# EAGLE design motor controller rev 3.0.6 (EAGLE 8.6.0)

## Sheet 1 of 2
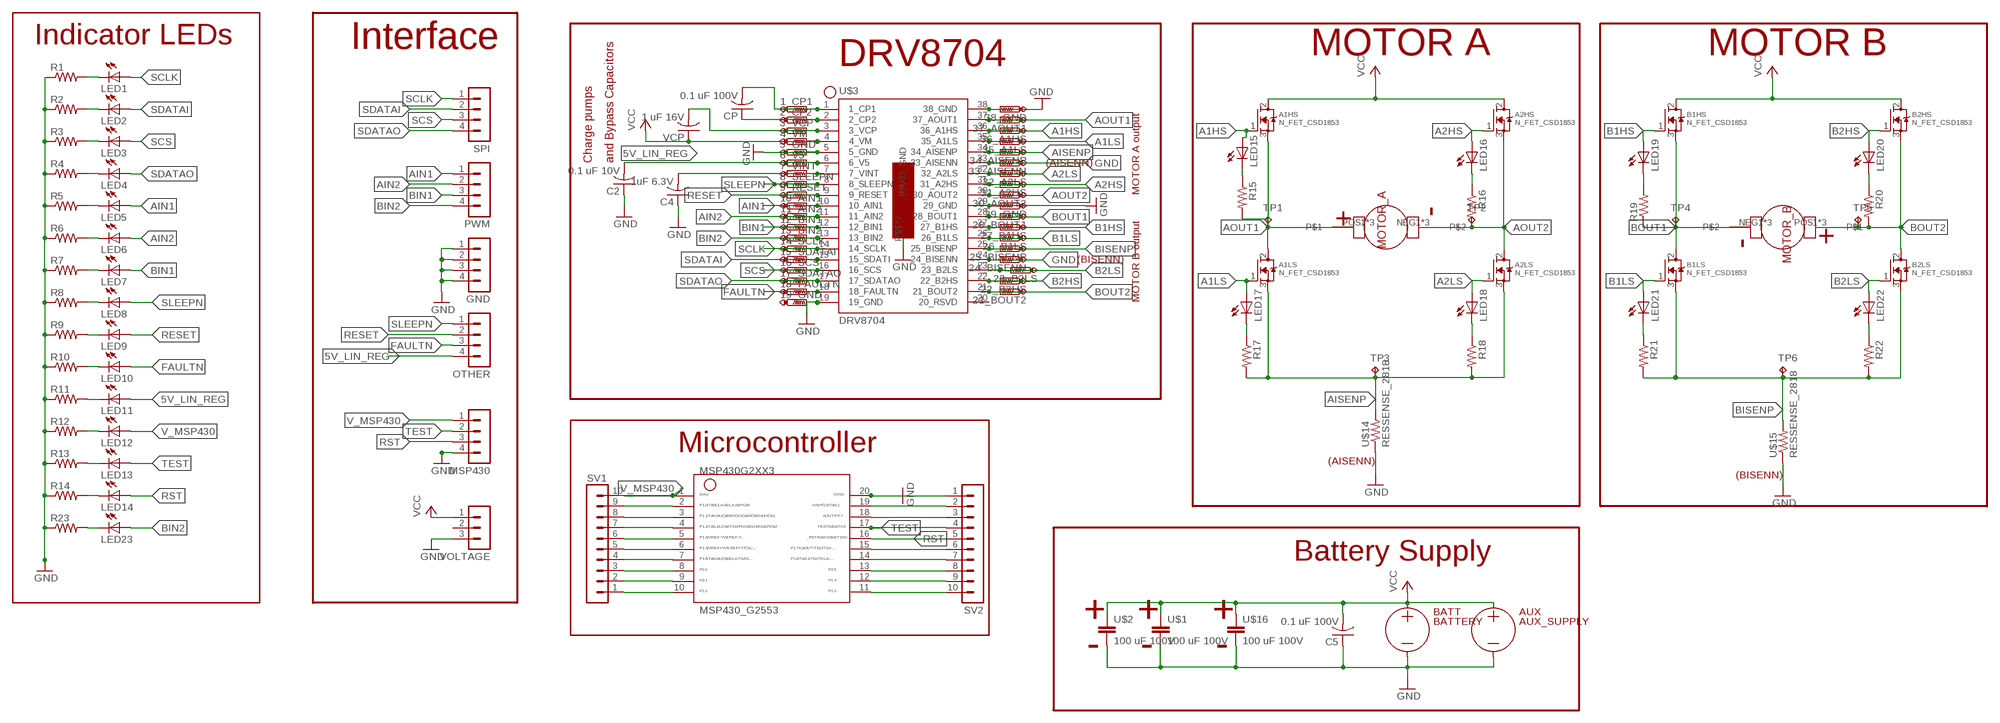
[diagram p0: schematic, sheet 1]

### Parts
1_CP1  PTR1TP10R  [TP10R]
2_CP2  PTR1TP10R  [TP10R]
3_VCP  PTR1TP10R  [TP10R]
4_VM  PTR1TP10R  [TP10R]
5_GND  PTR1TP10R  [TP10R]
6_V5  PTR1TP10R  [TP10R]
7_VINT  PTR1TP10R  [TP10R]
8_SLEEPN  PTR1TP10R  [TP10R]
9_RESET  PTR1TP10R  [TP10R]
10_AIN1  PTR1TP10R  [TP10R]
11_AIN2  PTR1TP10R  [TP10R]
12_BIN1  PTR1TP10R  [TP10R]
13_BIN2  PTR1TP10R  [TP10R]
14_SCLK  PTR1TP10R  [TP10R]
15_SDATAI  PTR1TP10R  [TP10R]
16_SCS  PTR1TP10R  [TP10R]
17_SDATAO  PTR1TP10R  [TP10R]
18_FAULTN  PTR1TP10R  [TP10R]
19_GND  PTR1TP10R  [TP10R]
21_BOUT2  PTR1TP10R  [TP10R]
22_B2HS  PTR1TP10R  [TP10R]
23_B2LS  PTR1TP10R  [TP10R]
24_BISENN  PTR1TP10R  [TP10R]
25_BISENP  PTR1TP10R  [TP10R]
26_B1LS  PTR1TP10R  [TP10R]
27_B1HS  PTR1TP10R  [TP10R]
28_BOUT1  PTR1TP10R  [TP10R]
29_GND  PTR1TP10R  [TP10R]
30_AOUT2  PTR1TP10R  [TP10R]
31_A2HS  PTR1TP10R  [TP10R]
32_A2LS  PTR1TP10R  [TP10R]
33_AISENN  PTR1TP10R  [TP10R]
34_AISENP  PTR1TP10R  [TP10R]
35_A1LS  PTR1TP10R  [TP10R]
36_A1HS  PTR1TP10R  [TP10R]
37_AOUT1  PTR1TP10R  [TP10R]
38_GND  PTR1TP10R  [TP10R]
A1HS  N_FET_CSD1853  [GDS_NFET]
A1LS  N_FET_CSD1853  [GDS_NFET]
A2HS  N_FET_CSD1853  [GDS_NFET]
A2LS  N_FET_CSD1853  [GDS_NFET]
AUX  AUX_SUPPLY  [PP14-45_RIGHT_ANGLE]
B1HS  N_FET_CSD1853  [GDS_NFET]
B1LS  N_FET_CSD1853  [GDS_NFET]
B2HS  N_FET_CSD1853  [GDS_NFET]
B2LS  N_FET_CSD1853  [GDS_NFET]
BATT  BATTERY  [SB50POWER_CLAW]
C2  0.1 uF 10V  C-USC0805K  [C0805K]
C4  1uF 6.3V  C-USC0805K  [C0805K]
C5  0.1 uF 100V  C-USC0805K  [C0805K]
CP  0.1 uF 100V  C-USC0805K  [C0805K]
GND  MA04-1  [MA04-1]
LED1  LEDCHIPLED_0805  [CHIPLED_0805]
LED2  LEDCHIPLED_0805  [CHIPLED_0805]
LED3  LEDCHIPLED_0805  [CHIPLED_0805]
LED4  LEDCHIPLED_0805  [CHIPLED_0805]
LED5  LEDCHIPLED_0805  [CHIPLED_0805]
LED6  LEDCHIPLED_0805  [CHIPLED_0805]
LED7  LEDCHIPLED_0805  [CHIPLED_0805]
LED8  LEDCHIPLED_0805  [CHIPLED_0805]
LED9  LEDCHIPLED_0805  [CHIPLED_0805]
LED10  LEDCHIPLED_0805  [CHIPLED_0805]
LED11  LEDCHIPLED_0805  [CHIPLED_0805]
LED12  LEDCHIPLED_0805  [CHIPLED_0805]
LED13  LEDCHIPLED_0805  [CHIPLED_0805]
LED14  LEDCHIPLED_0805  [CHIPLED_0805]
LED15  LEDCHIPLED_0805  [CHIPLED_0805]
LED16  LEDCHIPLED_0805  [CHIPLED_0805]
LED17  LEDCHIPLED_0805  [CHIPLED_0805]
LED18  LEDCHIPLED_0805  [CHIPLED_0805]
LED19  LEDCHIPLED_0805  [CHIPLED_0805]
LED20  LEDCHIPLED_0805  [CHIPLED_0805]
LED21  LEDCHIPLED_0805  [CHIPLED_0805]
LED22  LEDCHIPLED_0805  [CHIPLED_0805]
LED23  LEDCHIPLED_0805  [CHIPLED_0805]
MOTOR_A  MOTOR  [SB50POWER_CLAW]
MOTOR_B  MOTOR  [SB50POWER_CLAW]
MSP430  MA04-1  [MA04-1]
MSP430_G2553  G2XX3---N20  [N20]
OTHER  MA04-1  [MA04-1]
PWM  MA04-1  [MA04-1]
R1  R-US_R0805  [R0805]
R2  R-US_R0805  [R0805]
R3  R-US_R0805  [R0805]
R4  R-US_R0805  [R0805]
R5  R-US_R0805  [R0805]
R6  R-US_R0805  [R0805]
R7  R-US_R0805  [R0805]
R8  R-US_R0805  [R0805]
R9  R-US_R0805  [R0805]
R10  R-US_R0805  [R0805]
R11  R-US_R0805  [R0805]
R12  R-US_R0805  [R0805]
R13  R-US_R0805  [R0805]
R14  R-US_R0805  [R0805]
R15  R-US_R0805  [R0805]
R16  R-US_R0805  [R0805]
R17  R-US_R0805  [R0805]
R18  R-US_R0805  [R0805]
R19  R-US_R0805  [R0805]
R20  R-US_R0805  [R0805]
R21  R-US_R0805  [R0805]
R22  R-US_R0805  [R0805]
R23  R-US_R0805  [R0805]
SPI  MA04-1  [MA04-1]
SV1  MA10-1  [MA10-1]
SV2  MA10-1  [MA10-1]
TP1  TPB2,54  [B2,54]
TP2  TPB2,54  [B2,54]
TP3  TPB2,54  [B2,54]
TP4  TPB2,54  [B2,54]
TP5  TPB2,54  [B2,54]
TP6  TPB2,54  [B2,54]
U$1  100 uF 100V  LARGE_CAP  [UCY_HD_CAP]
U$2  100 uF 100V  LARGE_CAP  [UCY_HD_CAP]
U$3  DRV8704  [HTSSOP-38]
U$14  RESSENSE_2818  [2818_WITH_VIA]
U$15  RESSENSE_2818  [2818_WITH_VIA]
U$16  100 uF 100V  LARGE_CAP  [UCY_HD_CAP]
VCP  1 uF 16V  C-USC0805K  [C0805K]
VOLTAGE  MA03-1  [MA03-1]

### Nets
1_CP1: 1_CP1.TP CP.2 U$3.1(1_CP1)
2_CP2: 2_CP2.TP CP.1 U$3.2(2_CP2)
5V_LIN_REG: 6_V5.TP C2.2 LED11.A OTHER.4 U$3.6(6_V5)
A1HS: 36_A1HS.TP A1HS.1(G) LED15.A U$3.36(36_A1HS)
A1LS: 35_A1LS.TP A1LS.1(G) LED17.A U$3.35(35_A1LS)
A2HS: 31_A2HS.TP A2HS.1(G) LED16.A U$3.31(31_A2HS)
A2LS: 32_A2LS.TP A2LS.1(G) LED18.A U$3.32(32_A2LS)
AIN1: 10_AIN1.TP LED5.A PWM.1 U$3.10(10_AIN1)
AIN2: 11_AIN2.TP LED6.A PWM.2 U$3.11(11_AIN2)
AISENP: 34_AISENP.TP A1LS.3(S) A2LS.3(S) R17.2 R18.2 TP3.TP U$3.34(34_AISENP) U$14.P2.2 U$14.P$2
AOUT1: 37_AOUT1.TP A1HS.3(S) A1LS.2(D) MOTOR_A.POS1 MOTOR_A.POS2 MOTOR_A.POS3 R15.2 TP1.TP U$3.37(37_AOUT1)
AOUT2: 30_AOUT2.TP A2HS.3(S) A2LS.2(D) MOTOR_A.NEG1 MOTOR_A.NEG2 MOTOR_A.NEG3 R16.2 TP2.TP U$3.30(30_AOUT2)
B1HS: 27_B1HS.TP B1HS.1(G) LED19.A U$3.27(27_B1HS)
B1LS: 26_B1LS.TP B1LS.1(G) LED21.A U$3.26(26_B1LS)
B2HS: 22_B2HS.TP B2HS.1(G) LED20.A U$3.22(22_B2HS)
B2LS: 23_B2LS.TP B2LS.1(G) LED22.A U$3.23(23_B2LS)
BIN1: 12_BIN1.TP LED7.A PWM.3 U$3.12(12_BIN1)
BIN2: 13_BIN2.TP LED23.A PWM.4 U$3.13(13_BIN2)
BISENP: 25_BISENP.TP B1LS.3(S) B2LS.3(S) R21.2 R22.2 TP6.TP U$3.25(25_BISENP) U$15.P2.2 U$15.P$2
BOUT1: 28_BOUT1.TP B1HS.3(S) B1LS.2(D) MOTOR_B.NEG1 MOTOR_B.NEG2 MOTOR_B.NEG3 R19.1 TP4.TP U$3.28(28_BOUT1)
BOUT2: 21_BOUT2.TP B2HS.3(S) B2LS.2(D) MOTOR_B.POS1 MOTOR_B.POS2 MOTOR_B.POS3 R20.2 TP5.TP U$3.21(21_BOUT2)
FAULTN: 18_FAULTN.TP LED10.A OTHER.3 U$3.18(18_FAULTN)
GND: 5_GND.TP 19_GND.TP 24_BISENN.TP 29_GND.TP 33_AISENN.TP 38_GND.TP AUX.P$1(-) BATT.NEG1(-) BATT.NEG2(-) BATT.NEG3(-) C2.1 C4.1 C5.1 GND.1 GND.2 GND.3 GND.4 MSP430.4 MSP430_G2553.20 R1.1 R2.1 R3.1 R4.1 R5.1 R6.1 R7.1 R8.1 R9.1 R10.1 R11.1 R12.1 R13.1 R14.1 R23.1 SV2.1 U$1.- U$2.- U$3.5(5_GND) U$3.19(19_GND) U$3.24(24_BISENN) U$3.29(29_GND) U$3.33(33_AISENN) U$3.38(38_GND) U$3.P$1(PPAD_GND) U$3.P$2(PPAD_GND) U$3.P$3(PPAD_GND) U$3.P$4(PPAD_GND) U$3.PPAD0(PPAD_GND) U$3.PPAD1(PPAD_GND) U$3.PPAD2(PPAD_GND) U$14.P1.1 U$14.P$1 U$15.P1.1 U$15.P$1 U$16.- VOLTAGE.3
N$2: MSP430_G2553.2 SV1.9
N$3: MSP430_G2553.3 SV1.8
N$4: MSP430_G2553.4 SV1.7
N$5: MSP430_G2553.5 SV1.6
N$6: MSP430_G2553.6 SV1.5
N$7: MSP430_G2553.7 SV1.4
N$8: MSP430_G2553.8 SV1.3
N$9: MSP430_G2553.9 SV1.2
N$10: MSP430_G2553.10 SV1.1
N$11: MSP430_G2553.11 SV2.10
N$12: MSP430_G2553.12 SV2.9
N$13: MSP430_G2553.13 SV2.8
N$14: MSP430_G2553.14 SV2.7
N$15: MSP430_G2553.15 SV2.6
N$16: MSP430_G2553.18 SV2.3
N$17: MSP430_G2553.19 SV2.2
N$18: LED1.C R1.2
N$19: LED2.C R2.2
N$20: LED3.C R3.2
N$21: LED4.C R4.2
N$22: LED5.C R5.2
N$23: LED6.C R6.2
N$24: LED7.C R7.2
N$26: LED15.C R15.1
N$27: LED17.C R17.1
N$28: LED18.C R18.1
N$29: LED16.C R16.1
N$30: LED19.C R19.2
N$31: LED20.C R20.1
N$32: LED22.C R22.1
N$33: LED21.C R21.1
N$36: LED23.C R23.2
N$45: LED14.C R14.2
N$46: LED13.C R13.2
N$47: LED12.C R12.2
N$48: LED11.C R11.2
N$49: LED10.C R10.2
N$50: LED9.C R9.2
N$51: LED8.C R8.2
RESET: 9_RESET.TP LED9.A OTHER.2 U$3.9(9_RESET)
RST: LED14.A MSP430.3 MSP430_G2553.16 SV2.5
SCLK: 14_SCLK.TP LED1.A SPI.1 U$3.14(14_SCLK)
SCS: 16_SCS.TP LED3.A SPI.3 U$3.16(16_SCS)
SDATAI: 15_SDATAI.TP LED2.A SPI.2 U$3.15(15_SDATI)
SDATAO: 17_SDATAO.TP LED4.A SPI.4 U$3.17(17_SDATAO)
SLEEPN: 8_SLEEPN.TP LED8.A OTHER.1 U$3.8(8_SLEEPN)
TEST: LED13.A MSP430.2 MSP430_G2553.17 SV2.4
V_MSP430: LED12.A MSP430.1 MSP430_G2553.1 SV1.10
VCC: 4_VM.TP A1HS.2(D) A2HS.2(D) AUX.P$2(+) B1HS.2(D) B2HS.2(D) BATT.POS1(+) BATT.POS2(+) BATT.POS3(+) C5.2 U$1.+ U$2.+ U$3.4(4_VM) U$16.+ VCP.1 VOLTAGE.1
VCP: 3_VCP.TP U$3.3(3_VCP) VCP.2
VINT: 7_VINT.TP C4.2 U$3.7(7_VINT)
Unconnected: U$3.20(20_RSVD) VOLTAGE.2

### Notes on the sheet
- Indicator LEDs | Interface
- DRV8704 | MOTOR A | MOTOR B
- Charge pumps | and Bypass Capacitors
- (AISENN)
- MOTOR A output
- (BISENN)
- MOTOR B output
- Microcontroller
- (AISENN)
- (BISENN)
- Battery Supply

## Sheet 2 of 2

## Library data of the parts
1_CP1 2_CP2 3_VCP 4_VM 5_GND 6_V5 7_VINT 8_SLEEPN 9_RESET 10_AIN1 11_AIN2 12_BIN1 13_BIN2 14_SCLK 15_SDATAI 16_SCS 17_SDATAO 18_FAULTN 19_GND 21_BOUT2 22_B2HS 23_B2LS 24_BISENN 25_BISENP 26_B1LS 27_B1HS 28_BOUT1 29_GND 30_AOUT2 31_A2HS 32_A2LS 33_AISENN 34_AISENP 35_A1LS 36_A1HS 37_AOUT1 38_GND = motor controller rev 3.0.6:PTR1: TEST PIN
A1HS A1LS A2HS A2LS B1HS B1LS B2HS B2LS = motor controller rev 3.0.6:N_FET_CSD1853
AUX = motor controller rev 3.0.6:AUX_SUPPLY: Used for sending 48V to the buck converter that connects to the auxillary circuit
BATT = motor controller rev 3.0.6:BATTERY
C2 C4 C5 CP VCP = motor controller rev 3.0.6:C-US: CAPACITOR, American symbol
GND MSP430 OTHER PWM SPI = motor controller rev 3.0.6:MA04-1: PIN HEADER; OC_FARNELL: unknown; OC_NEWARK: unknown
LED1-LED23 = motor controller rev 3.0.6:LED: LED OSRAM: - CHIPLED LG R971, LG N971, LY N971, LG Q971, LY Q971, LO R971, LY R971 LH N974, LH R974 LS Q976, LO Q976, LY Q976 LO Q996 - Hyper CHIPLED LW Q18S LB Q993, LB Q99A, LB R99A - SideLED LS A670, LO A670, LY A670, LG A670, LP A670 LB A673, LV A673, LT A673, LW A673 LH A674 LY A675 LS A676, LA A676, LO A676, LY A676, LW A676 LS A679, LY A679, LG A679 - Hyper Micro SIDELED® LS Y876, LA Y876, LO Y876, LY Y876 LT Y87S - SmartLED LW L88C, LW L88S LB L89C, LB L89S, LG L890 LS L89K, LO L89K, LY L89K LS L896, LA L896, LO L896, LY L896 - TOPLED LS T670, LO T670, LY T670, LG T670, LP T670 LSG T670, LSP T670, LSY T670, LOP T670, LYG T670 LG T671, LOG T671, LSG T671 LB T673, LV T673, LT T673, LW T673 LH T674 LS T676, LA T676, LO T676, LY T676, LB T676, LH T676, LSB T676, LW T676 LB T67C, LV T67C, LT T67C, LS T67K, LO T67K, LY T67K, LW E67C LS E67B, LA E67B, LO E67B, LY E67B, LB E67C, LV E67C, LT E67C LW T67C LS T679, LY T679, LG T679 LS T770, LO T770, LY T770, LG T770, LP T770 LB T773, LV T773, LT T773, LW T773 LH T774 LS E675, LA E675, LY E675, LS T675 LS T776, LA T776, LO T776, LY T776, LB T776 LHGB T686 LT T68C, LB T68C - Hyper Mini TOPLED® LB M676 - Mini TOPLED Santana® LG M470 LS M47K, LO M47K, LY M47K Source: http://www.osram.convergy.de LUXEON: - LUMILED® LXK2-PW12-R00, LXK2-PW12-S00, LXK2-PW14-U00, LXK2-PW14-V00 LXK2-PM12-R00, LXK2-PM12-S00, LXK2-PM14-U00 LXK2-PE12-Q00, LXK2-PE12-R00, LXK2-PE12-S00, LXK2-PE14-T00, LXK2-PE14-U00 LXK2-PB12-K00, LXK2-PB12-L00, LXK2-PB12-M00, LXK2-PB14-N00, LXK2-PB14-P00, LXK2-PB14-Q00 LXK2-PR12-L00, LXK2-PR12-M00, LXK2-PR14-Q00, LXK2-PR14-R00 LXK2-PD12-Q00, LXK2-PD12-R00, LXK2-PD12-S00 LXK2-PH12-R00, LXK2-PH12-S00 LXK2-PL12-P00, LXK2-PL12-Q00, LXK2-PL12-R00 Source: www.luxeon.com KINGBRIGHT: KA-3528ASYC Source: www.kingbright.com
MOTOR_A MOTOR_B = motor controller rev 3.0.6:MOTOR
MSP430_G2553 = motor controller rev 3.0.6:G2XX3---N20: MSP430G2XX1 PDIP (N) 20 Pin Package
R1-R23 = motor controller rev 3.0.6:R-US_: RESISTOR, American symbol
SV1 SV2 = motor controller rev 3.0.6:MA10-1: PIN HEADER; OC_FARNELL: unknown; OC_NEWARK: unknown
TP1-TP6 = motor controller rev 3.0.6:TP: Test pad
U$1 U$2 U$16 = motor controller rev 3.0.6:LARGE_CAP
U$3 = motor controller rev 3.0.6:DRV8704
U$14 U$15 = motor controller rev 3.0.6:RESSENSE_2818
VOLTAGE = motor controller rev 3.0.6:MA03-1: PIN HEADER; OC_FARNELL: unknown; OC_NEWARK: unknown

## Board
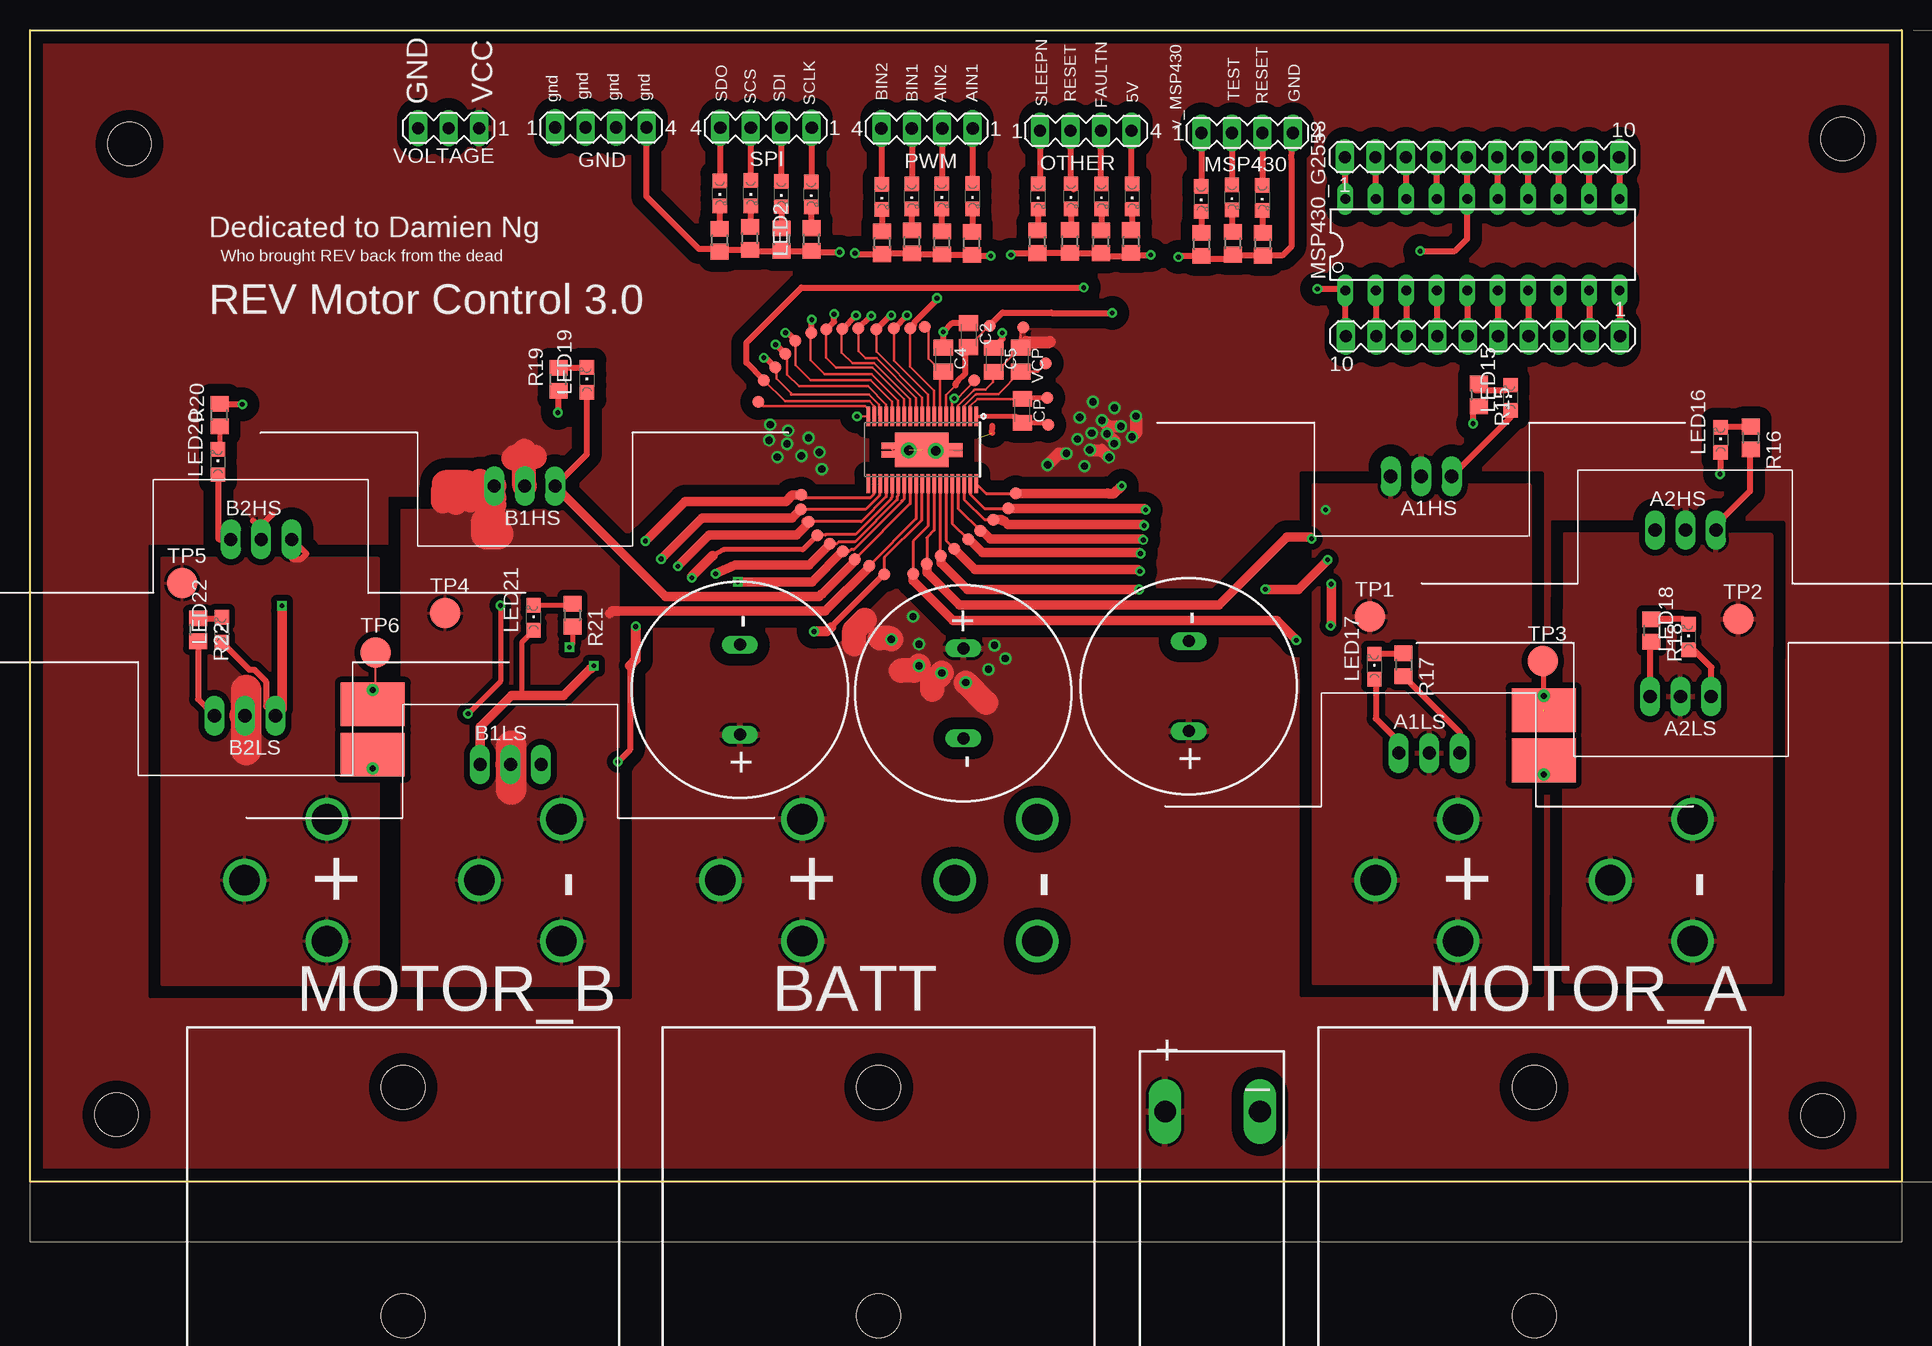
[diagram p1: board, top side]
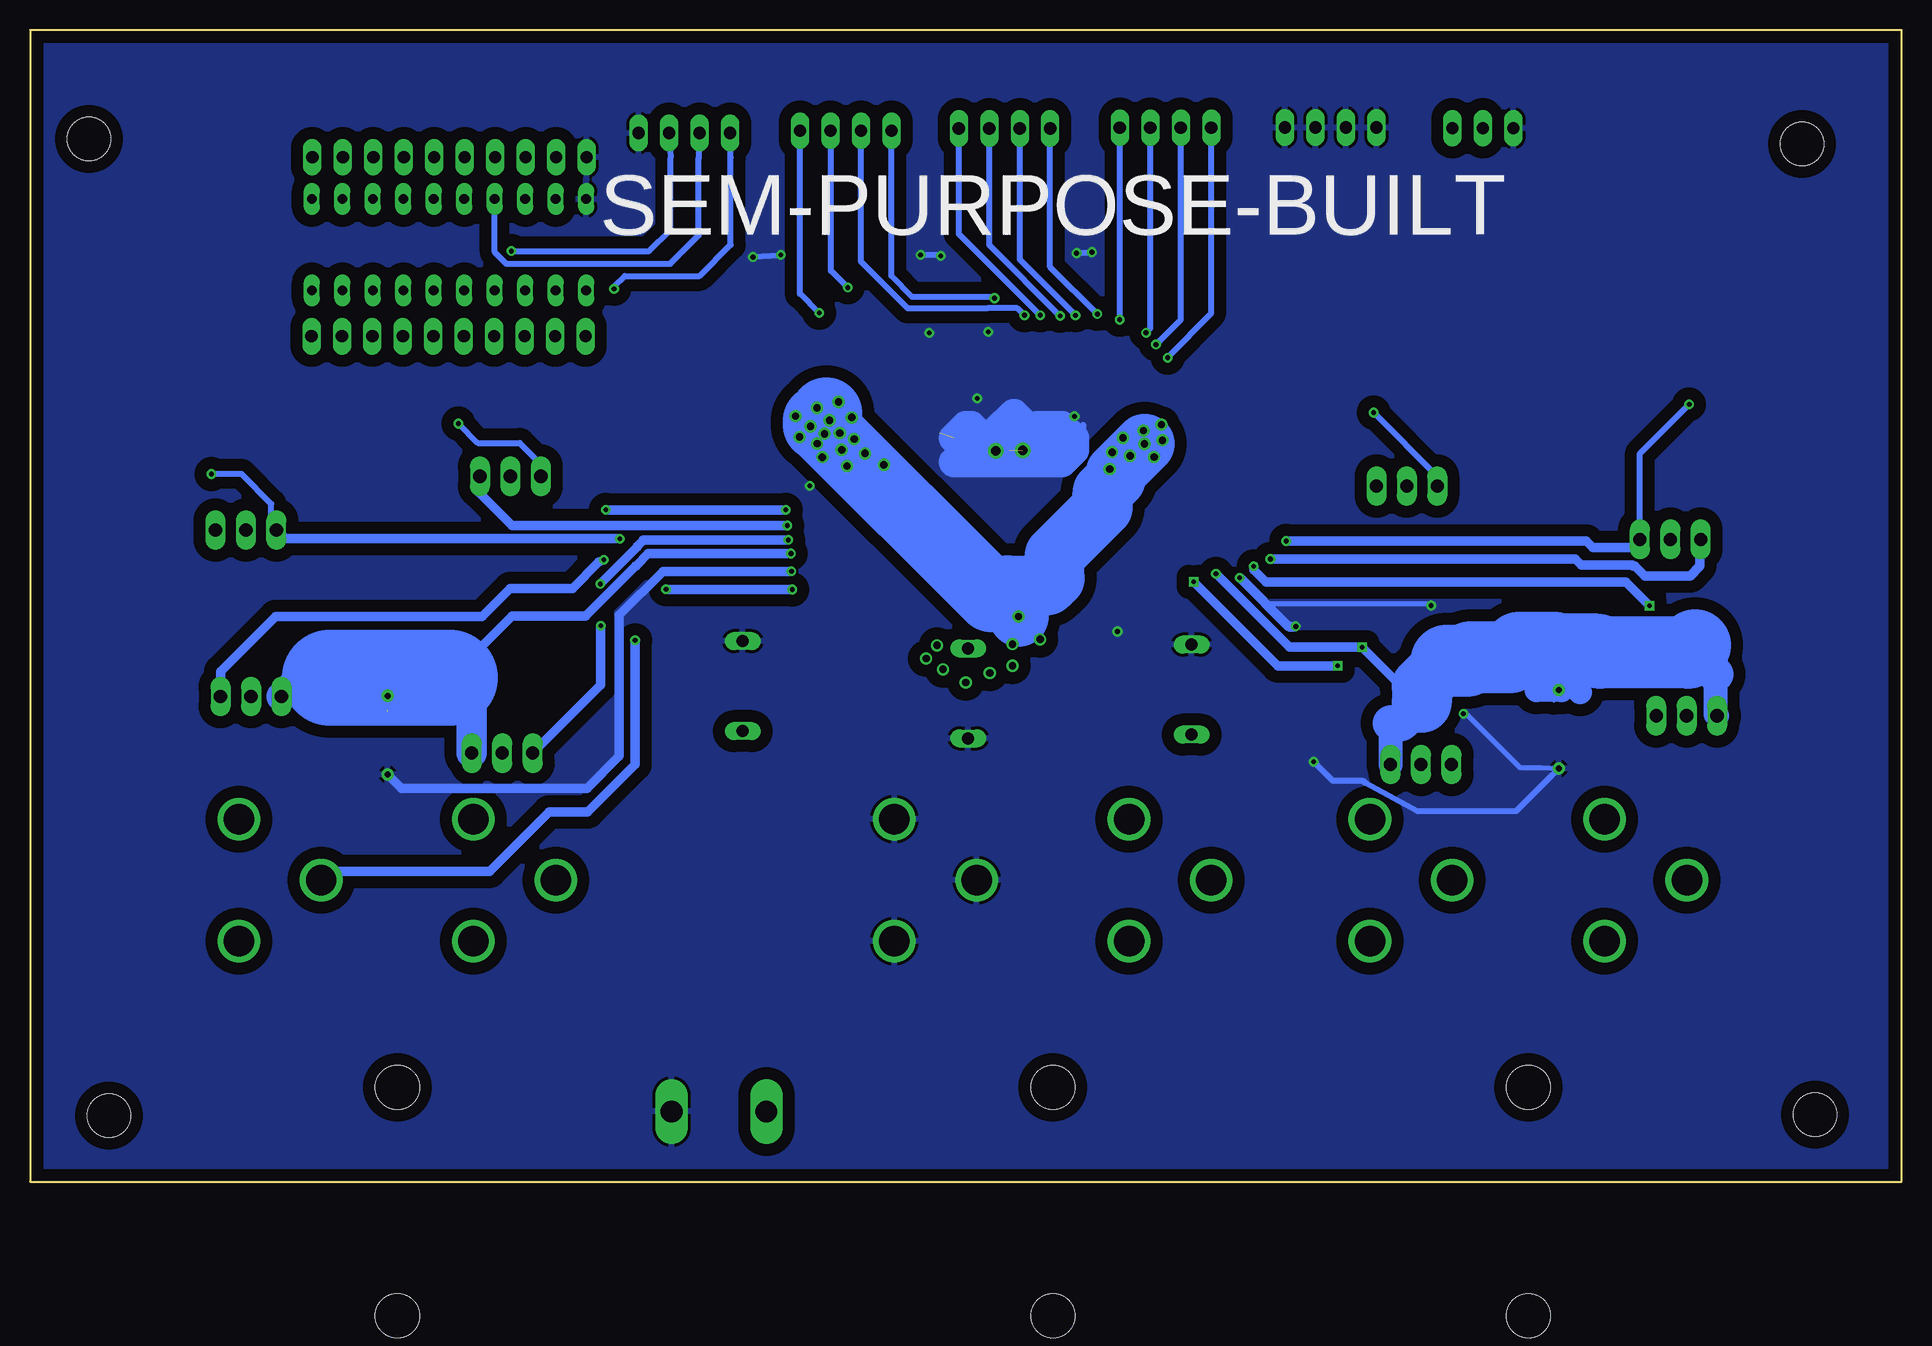
[diagram p2: board, bottom side, seen from below]

Size 156 x 96 mm. Coordinates in mm from the lower left corner, seen from the top.
Outline: 0,96 156,96 156,0 0,0 0,96
Copper layers (1*16): Top 0.035mm / dielectric 1.5mm / Bottom 0.035mm
Design rules "default *": minimum track width 6mil, minimum drill 0.4mm, track to track 6mil, track to pad 6mil, pad to pad 6mil, via to via 6mil, smd to smd 6mil, copper to edge 40mil, drill to drill 0.4mm, minimum pad ring 10mil, minimum via ring 8mil, stop-mask expansion 4mil, vias tented up to drill 0mil, thermal gap 10mil
Holes 3.6 mm at 7.2,5.6 8.3,86.5 151.1,86.9 149.4,5.5

### Footprints (pad centres in the part's own frame; a part is rotated, then mirrored left to right if it is on the bottom)
TP10R = smd 1 x 1: TP 0,0
GDS_NFET = drill 1.1 long: 1 -3.54,0; 2 -1,0; 3 1.54,0
PP14-45_RIGHT_ANGLE = drill 1.8 long: P$1 0,0; P$2 7.9,0
SB50POWER_CLAW = drill 2.54: NEG1 -22.35,13.21; NEG2 -17.27,6.35; NEG3 -12.19,13.21; POS1 -22.35,-6.35; POS2 -17.27,-13.21; POS3 -12.19,-6.35 | hole 3.66: 0,0; 19.05,0
C0805K = smd 1.3 x 1.6: 1 -1,0; 2 1,0
MA04-1 = drill 1.016 long: 1 -3.81,0; 2 -1.27,0; 3 1.27,0; 4 3.81,0
CHIPLED_0805 = smd 1.2 x 1.2: A 0,-1.05; C 0,1.05
N20 = drill 0.813 long: 1 -11.435,-3.81; 2 -8.895,-3.81; 3 -6.355,-3.81; 4 -3.815,-3.81; 5 -1.275,-3.81; 6 1.265,-3.81; 7 3.805,-3.81; 8 6.345,-3.81; 9 8.885,-3.81; 10 11.425,-3.81; 11 11.425,3.81; 12 8.885,3.81; 13 6.345,3.81; 14 3.805,3.81; 15 1.265,3.81; 16 -1.275,3.81; 17 -3.815,3.81; 18 -6.355,3.81; 19 -8.895,3.81; 20 -11.435,3.81
R0805 = smd 1.3 x 1.5: 1 -0.95,0; 2 0.95,0
MA10-1 = drill 1.016 long: 1 -11.43,0; 2 -8.89,0; 3 -6.35,0; 4 -3.81,0; 5 -1.27,0; 6 1.27,0; 7 3.81,0; 8 6.35,0; 9 8.89,0; 10 11.43,0
B2,54 = smd 2.54 x 2.54: TP 0,0
UCY_HD_CAP = drill 1 long: + 3.75,0; - -3.75,0
HTSSOP-38 = smd 0.3 x 1.6: 1 9.15,-0.8; 2 8.65,-0.8; 3 8.15,-0.8; 4 7.65,-0.8; 5 7.15,-0.8; 6 6.65,-0.8; 7 6.15,-0.8; 8 5.65,-0.8; 9 5.15,-0.8; 10 4.65,-0.8; 11 4.15,-0.8; 12 3.65,-0.8; 13 3.15,-0.8; 14 2.65,-0.8; 15 2.15,-0.8; 16 1.65,-0.8; 17 1.15,-0.8; 18 0.65,-0.8; 19 0.15,-0.8; 20 0.15,-6.4; 21 0.65,-6.4; 22 1.15,-6.4; 23 1.65,-6.4; 24 2.15,-6.4; 25 2.65,-6.4; 26 3.15,-6.4; 27 3.65,-6.4; 28 4.15,-6.4; 29 4.65,-6.4; 30 5.15,-6.4; 31 5.65,-6.4; 32 6.15,-6.4; 33 6.65,-6.4; 34 7.15,-6.4; 35 7.65,-6.4; 36 8.15,-6.4; 37 8.65,-6.4; 38 9.15,-6.4 | smd 1.15 x 0.54: P$1 7.43,-3.3; P$2 7.42,-3.94; P$3 1.81,-3.96; P$4 1.81,-3.24 | smd 4.48 x 2.9: PPAD0 4.617,-3.596 | drill 0.8: PPAD1 3.532,-3.632; PPAD2 5.771,-3.661
2818_WITH_VIA = drill 0.5: P1.1 0.66,2.665; P2.2 7.21,2.665 | smd 3.63 x 5.33: P$1 1.815,2.665; P$2 6.005,2.665
MA03-1 = drill 1.016 long: 1 -2.54,0; 2 0,0; 3 2.54,0

### Placement (x,y rotation side)
1_CP1  84.86,63.08 0 top
2_CP2  84.81,65.32 0 top
3_VCP  84.68,68.19 0 top
4_VM  82.78,71.21 0 top
5_GND  78.72,66.78 0 top
6_V5  79.99,71.35 0 top
7_VINT  74.59,71.24 0 top
8_SLEEPN  73.39,71.13 0 top
9_RESET  72.02,71.12 0 top
10_AIN1  70.55,71.06 0 top
11_AIN2  69.04,71.11 0 top
12_BIN1  67.72,71.08 0 top
13_BIN2  66.39,71.03 0 top
14_SCLK  65.12,70.77 0 top
15_SDATAI  63.8,70.09 0 top
16_SCS  62.95,69.01 0 top
17_SDATAO  62.12,67.88 0 top
18_FAULTN  61.16,66.81 0 top
19_GND  60.72,65.02 0 top
21_BOUT2  64.28,57.23 0 top
22_B2HS  64.24,56.04 0 top
23_B2LS  64.93,55.01 0 top
24_BISENN  65.62,53.89 0 top
25_BISENP  66.66,53.16 0 top
26_B1LS  67.73,52.55 0 top
27_B1HS  68.75,51.89 0 top
28_BOUT1  69.96,51.35 0 top
29_GND  71.19,50.64 0 top
30_AOUT2  73.61,50.66 0 top
31_A2HS  74.75,51.51 0 top
32_A2LS  75.92,52.15 0 top
33_AISENN  77.06,52.76 0 top
34_AISENP  78.19,53.55 0 top
35_A1LS  79.21,54.26 0 top
36_A1HS  80.31,55.17 0 top
37_AOUT1  81.53,56.12 0 top
38_GND  82.16,57.36 0 top
A1HS  114.96,58.8 180 top
A1LS  117.64,35.72 0 top
A2HS  139,54.31 0 top
A2LS  136.58,40.44 180 top
AUX  102.52,5.85 180 top
B1HS  40.23,57.98 180 top
B1LS  41.06,34.77 0 top
B2HS  20.27,53.53 0 top
B2LS  16.91,38.84 180 top
BATT  70.74,7.86 270 top
C2  78.24,70.56 270 top
C4  76.13,68.52 270 top
C5  80.33,68.51 270 top
CP  82.72,64.26 270 top
GND  47.58,87.87 0 top
LED1  65.11,82.29 180 top
LED2  62.63,82.32 180 top
LED3  60.07,82.4 180 top
LED4  57.49,82.38 180 top
LED5  78.56,82.15 180 top
LED6  75.99,82.14 180 top
LED7  73.49,82.12 180 top
LED8  84.03,82.11 180 top
LED9  86.77,82.14 180 top
LED10  89.31,82.12 180 top
LED11  91.87,82.11 180 top
LED12  97.63,81.92 180 top
LED13  100.19,82.04 180 top
LED14  102.72,82 180 top
LED15  123.42,65.35 0 top
LED16  140.93,61.83 0 top
LED17  112.06,42.93 0 top
LED18  138.25,45.4 0 top
LED19  46.43,66.83 0 top
LED20  15.67,59.99 0 top
LED21  41.98,47 0 top
LED22  16,46 0 top
LED23  71,82.08 180 top
MOTOR_A  125.38,7.86 270 top
MOTOR_B  31.1,7.86 270 top
MSP430  101.46,87.41 0 top
MSP430_G2553  121.08,78.1 0 top
OTHER  88.01,87.6 0 top
PWM  74.77,87.79 180 top
R1  65.15,78.53 90 top
R2  62.66,78.52 90 top
R3  60.01,78.62 90 top
R4  57.49,78.47 90 top
R5  78.5,78.21 90 top
R6  76.01,78.25 90 top
R7  73.51,78.33 90 top
R8  83.97,78.35 90 top
R9  86.69,78.38 90 top
R10  89.27,78.35 90 top
R11  91.79,78.36 90 top
R12  97.66,78.13 90 top
R13  100.26,78.22 90 top
R14  102.76,78.14 90 top
R15  120.78,65.59 270 top
R16  143.42,61.99 270 top
R17  114.49,43.09 270 top
R18  135.16,45.94 270 top
R19  44.05,66.88 90 top
R20  15.8,63.9 90 top
R21  45.21,47.22 270 top
R22  14,46 270 top
R23  71.04,78.26 90 top
SPI  61.35,87.86 180 top
SV1  121.11,70.47 180 top
SV2  121.03,85.4 0 top
TP1  111.7,47.1 0 top
TP2  142.4,46.9 0 top
TP3  126.1,43.4 0 top
TP4  34.6,47.4 0 top
TP5  12.7,49.9 0 top
TP6  28.8,44.1 0 top
U$1  77.8,40.7 90 top
U$2  96.6,41.3 270 top
U$3  69.72,64.59 0 top
U$14  128.85,33.29 90 top
U$15  31.23,33.77 90 top
U$16  59.18,41.01 270 top
VCP  82.58,68.52 270 top
VOLTAGE  34.9,87.82 180 top

### Tracks (layer width: path | path; a pad name or v marks a point on that pad's centre or on a via)
1_CP1
  Top 0.3: U$3.1 79.43,63.79 79.44,63.8
  Top 0.4: CP.2 82.19,63.79 | CP.2 84.68,63.26 1_CP1.TP | 79.44,63.8 82.18,63.8 CP.2
2_CP2
  Top 0.2: U$3.2 78.37,64.65 78.96,65.24 82.7,65.24 CP.1
  Top 0.4: 2_CP2.TP 82.78,65.32 CP.1
5V_LIN_REG  (via drill 0.4)
  Top 0.2: U$3.6 76.37,64.92 76.36,64.94 76.36,65.56 77.16,66.36 | 77.95,69.27 C2.2 78.24,69.6 6_V5.TP
  Top 0.5: 77.16,66.36 77.16,66.53 77.33,66.7 77.33,66.74 77.96,67.37 77.96,69.28 C2.2 | OTHER.4 91.82,83.21 LED11.A | 6_V5.TP 81.08,72.44 85.12,72.44 85.15,72.41 v90.21,72.41
  Bottom 0.5: v90.21,72.41 91.82,74.02 OTHER.4
A1HS  (via drill 0.4)
  Top 0.254: U$3.36 77.87,56.87 79.57,55.17 36_A1HS.TP
  Top 0.5: A1HS.1 123.42,63.72 LED15.A
  Top 0.8: 36_A1HS.TP 80.99,55.17 81.09,55.07 81.22,55.07 81.51,54.78 92.78,54.78 v92.87,54.69
  Bottom 0.8: v92.87,54.69 115.82,54.69 118.57,57.44 118.57,58.73 A1HS.1
A1LS  (via drill 0.4)
  Top 0.254: U$3.35 77.37,56.1 35_A1LS.TP
  Top 0.5: LED17.A 112.18,41.76 112.18,38.59 114.1,36.67 A1LS.1
  Top 0.8: 35_A1LS.TP 79.35,54.26 80.05,53.56 92.73,53.56 v92.8,53.49 | v108.46,49.82 108.46,46.38 v108.42,46.34
  Bottom 0.8: v92.8,53.49 104.89,53.49 104.89,53.43 105.39,52.93 105.39,52.89 v108.46,49.82 | v108.42,46.34 108.42,41.4 A1LS.1
A2HS  (via drill 0.4)
  Top 0.254: U$3.31 75.37,54.29 74.75,53.67 31_A2HS.TP
  Top 0.5: v140.88,58.98 140.93,59.03 LED16.A
  Top 0.8: 31_A2HS.TP 74.75,50.77 77.47,48.05 99.1,48.05 104.76,53.71 106.72,53.71 v106.84,53.59
  Bottom 0.5: A2HS.1 135.88,54.73 135.88,56.5 138.36,58.98 v140.88,58.98
  Bottom 0.8: v106.84,53.59 134.74,53.59 A2HS.1
A2LS  (via drill 0.4)
  Top 0.254: U$3.32 75.87,52.2 32_A2LS.TP
  Top 0.5: A2LS.1 140.15,40.47 140.15,42.86 138.66,44.35 LED18.A
  Top 0.8: 32_A2LS.TP 75.92,51.58 78.16,49.34 92.44,49.34 v92.46,49.36 | v102.98,49.37 105.71,49.37 v108.17,51.83
  Bottom 0.8: v102.98,49.37 v102.97,49.36 v92.46,49.36 | v108.17,51.83 108.61,51.63 110.79,49.45 115.97,49.45 118.33,47.09 135.54,47.09 140.1,42.53 140.1,40.46 A2LS.1
AIN1  (via drill 0.4)
  Top 0.2: U$3.10 74.37,65.36 70.55,69.18 10_AIN1.TP
  Top 0.5: PWM.1 78.58,83.22 LED5.A | 10_AIN1.TP 71.71,72.22 v71.8,72.22
  Bottom 0.5: v71.8,72.22 78.58,79 PWM.1
AIN2  (via drill 0.4)
  Top 0.2: U$3.11 73.87,65.33 70.56,68.64 69.66,68.64 69.07,69.23 69.07,71.08 11_AIN2.TP
  Top 0.5: PWM.2 76.04,83.24 LED6.A | 11_AIN2.TP 70.09,72.16 v70.13,72.16
  Bottom 0.5: v70.13,72.16 76.04,78.07 PWM.2
AISENP  (via drill 0.4)  (1 unrouted)
  Top 0.254: U$3.34 76.87,54.87 34_AISENP.TP
  Top 0.4: 126.19,40 126.19,42.98 TP3.TP
  Top 0.5: R17.2 119.18,37.45 A1LS.3 | R18.2 135.04,44.87 A2LS.3
  Top 0.508: U$14.P$2 126.19,40
  Top 0.8: 34_AISENP.TP 78.28,53.55 79.39,52.44 92.48,52.44 v92.57,52.35
  Bottom 0.152: U$14.P2.2 125.1,41.59 | 119.01,43.95 119.05,43.95 121,42
  Bottom 0.8: v92.57,52.35 104.47,52.35 105.5,51.32 105.51,51.32 109.67,47.16 110.74,47.16 110.75,47.15 115.81,47.15 119.01,43.95
  Bottom 0.813: 125,42 126.19,40.81 U$14.P2.2 126.19,39.19 126,39
  Bottom 2.54: A1LS.3 119.18,40.18 121,42 | 131,42 133.48,42 A2LS.3 | 126.19,40.81 126,41
  Bottom 8: 121,42 125,42 131,42
AOUT1  (via drill 0.4)
  Top 0.152: R15.2 120.29,64.15
  Top 0.254: U$3.37 78.37,57.3 79.55,56.12 37_AOUT1.TP
  Top 0.5: 120.29,64.15 v120.29,63.19
  Top 0.8: 37_AOUT1.TP 92.88,56.12 v93,56
  Bottom 0.5: v120.29,63.19 118.68,61.58 115.18,61.58 113.42,59.82 A1HS.3
  Bottom 0.8: v93,56 v108,56
  pour Top (isolate 0.5): 107,16.6 125,16.6 125,58 107,58
AOUT2  (via drill 0.4)
  Top 0.254: U$3.30 74.87,54.65 73.61,53.39 30_AOUT2.TP
  Top 0.5: R16.2 143.36,60.98 143.36,57.55 140.54,54.73 A2HS.3
  Top 0.8: 30_AOUT2.TP 73.61,50.11 76.95,46.77 103.92,46.77 v105.56,45.13
  Bottom 0.8: v105.56,45.13 105.56,34.77 109.52,30.81 112.73,30.81 117.67,25.87 130.99,25.87 MOTOR_A.NEG2
  pour Top (isolate 0.5): 145,16.6 127.9,16.7 128,54 145.1,53.9
B1HS
  Top 0.254: U$3.27 73.37,56.51 27_B1HS.TP
  Top 0.5: B1HS.1 46.43,60.64 LED19.A
  Top 0.8: 27_B1HS.TP 68.75,51.75 66,49 65.98,49 65.75,48.77 52.98,48.77 B1HS.1
B1LS  (via drill 0.4)
  Top 0.254: U$3.26 72.87,56.94 72.88,56.93 72.69,56.74 72.69,56.67 68.68,52.67 68.43,52.67 68.31,52.55 26_B1LS.TP
  Top 0.406: 41,40.52 41,44.97 LED21.A
  Top 0.8: B1LS.1 37.52,37.89 40.15,40.52 41,40.52 44.49,40.52 46.69,42.72 46.72,42.72 v47,43 | v59,50 65.18,50 26_B1LS.TP
  Bottom 0.8: v47,43 52,43 v59,50
B2HS  (via drill 0.4)
  Top 0.254: U$3.22 70.8,58.12 70.8,57.2 69.65,56.04 22_B2HS.TP
  Top 0.406: B2HS.1 16.73,53.57
  Top 0.5: LED20.A 15.7,58.91 15.7,53.6 15.77,53.53 B2HS.1
  Top 0.8: 22_B2HS.TP 63.5,55.3 56,55.3 v52.6,51.9
  Bottom 0.8: B2HS.1 16.8,53.46 16.8,51.3 17.6,50.5 21.4,50.5 22.23,51.33 22.38,51.33 22.45,51.4 26.7,51.4 27.2,51.9 v52.6,51.9
B2LS  (via drill 0.4)
  Top 0.254: U$3.23 71.37,57.08 69.3,55.01 23_B2LS.TP
  Top 0.5: B2LS.1 19.67,39.62 19.67,41.69 18.69,42.67 18.28,42.67 LED22.A
  Top 0.8: 64.68,54.99 64.7,55.01 23_B2LS.TP 64.93,54.93 63.9,53.9 56.6,53.9 v54,51.3 | v21,48 21,39.39 B2LS.1
  Bottom 0.8: v21,48 23,50 53,50 54,51 v54,51.3
BIN1  (via drill 0.4)
  Top 0.2: U$3.12 73.37,65.21 70.37,68.22 68.55,68.22 67.65,69.12 67.65,71.01 12_BIN1.TP
  Top 0.5: PWM.3 73.5,83.14 73.86,82.78 73.86,82.8 LED7.A | 12_BIN1.TP v68.85,72.21
  Bottom 0.5: v68.85,72.21 73.5,76.86 PWM.3
BIN2  (via drill 0.4)
  Top 0.2: U$3.13 72.87,65.22 70.22,67.87 67.17,67.87 66.36,68.68 66.36,71 13_BIN2.TP
  Top 0.5: PWM.4 70.96,83.17 LED23.A | 13_BIN2.TP 67.03,71.67 v67.03,72.32
  Bottom 0.5: v67.03,72.32 70.96,76.25 PWM.4
BISENP  (via drill 0.4)
  Top 0.152: TP6.TP 28.8,40.01 U$15.P$2 U$15.P2.2
  Top 0.254: U$3.25 72.37,57.24 72.39,57.22 72.28,57.11 72.28,56.84 68.77,53.33 67.41,53.33 67.24,53.16 25_BISENP.TP | 28.8,41.22 U$15.P2.2
  Top 0.406: R21.2 45.21,44.8 v44.96,44.55
  Top 0.5: R22.2 14,40.21 B2LS.3
  Top 0.8: 25_BISENP.TP 66.66,53.12 64.94,51.4 58.78,51.4 v57.15,50.67
  Bottom 0.152: U$15.P2.2 28.57,40.44 29,40
  Bottom 0.8: v57.15,50.67 51.03,44.55 v44.96,44.55 41.71,41.3 40,41.3
  Bottom 0.813: 28.34,40.96 28.55,40.96 U$15.P2.2 28.57,44.05 28.53,44.08
  Bottom 2: B2LS.3 15.5,38.97 15.5,42.3 | 42.6,38.2 B1LS.3 | 26.81,40.81 27.2,41.2 27.2,42.1 28.34,40.96 30.4,40.96
  Bottom 3: 15.5,42.3 17.2,44 17.2,44.7 | 40,39.9 41.7,38.2 42.6,38.2
  Bottom 5: 37.9,43.4 40,41.3 40,39.9
  Bottom 6: 17.2,44.7 17.8,44.1 25.11,44.1 25.35,44.34 28.27,44.34 28.53,44.08 28.94,44.49 31.86,44.49 32.65,43.7 35.9,43.7 36.2,43.4 37.9,43.4
BOUT1  (via drill 0.4)
  Top 0.254: U$3.28 73.87,55.26 28_BOUT1.TP
  Top 0.5: R19.1 44,65.88 v44,64.1
  Top 0.8: 28_BOUT1.TP 69.96,51.25 66.28,47.57 48.54,47.57 48.31,47.34
  Top 2: B1HS.3 38.2,57.49 38.2,55.9 38.7,56.4 38.7,57 37.5,58.2 37.5,58.4 37.1,58 36.9,58 36.9,57.3 36.7,57.1 36.7,56.8 36,57.5 36,57.9 35.5,57.4 35.5,56.6 36.5,57.6 36.5,58.3 34.6,58.3 34.5,58.2 34.5,57.7 34.4,57.6 34.4,56.7
  Top 2.54: 38.69,55 38,55 38,54 39,54 | B1LS.2 40.1,34.73 | 40.1,34.73 40.1,32.7 | 40.1,34.73 40.1,36.3
  Bottom 0.5: v44,64.1 38.69,58.79 B1HS.3
  pour Top (isolate 0.5): 31,56 49,56 49,16.3 31,16.3
BOUT2  (via drill 0.4)
  Top 0.254: U$3.21 70.3,58.12 70.3,57.27 70.03,57 64.51,57 21_BOUT2.TP
  Top 0.5: R20.2 15.85,64.8 v17.7,64.8 | 21.87,53.53 B2HS.3 21.81,51.99 21.9,51.9 22.6,51.9 23.05,52.35 21.87,53.53
  Top 0.8: 21_BOUT2.TP 63.53,57.23 63,56.7 54.6,56.7 v51.3,53.4
  Top 2.54: 18,38.84 18,36 | B2LS.2 18,38.84 | 18,38.84 18,41
  Bottom 0.5: v17.7,64.8 21.81,60.69 B2HS.3 22.49,52.85
  Bottom 0.8: v51.3,53.4 26.27,53.4 25.72,52.85 22.49,52.85
  pour Top (isolate 0.5): 11,52 29,52 29,16.4 11,16.4
FAULTN  (via drill 0.4)
  Top 0.2: U$3.18 70.37,64.67 69.99,65.05 62.92,65.05 18_FAULTN.TP
  Top 0.5: OTHER.3 89.28,83.2 LED10.A | 18_FAULTN.TP 59.71,68.26 59.71,69.93 64.31,74.53 v87.83,74.53
  Bottom 0.5: OTHER.3 89.23,85.55 89.23,75.93 v87.83,74.53
GND  (via drill 0.4)  (2 unrouted)
  Top 0.152: U$14.P$1 U$14.P1.1 | 70,63.53 69.87,63.65 U$3.19 v68.94,63.79 | U$3.P$1 76.79,60.93 | 76.79,60.93 U$3.PPAD2 | U$3.P$2 76.86,60.93 76.79,60.93 | U$3.P$4 71.93,60.96 U$3.PPAD1 72.93,60.63 U$3.P$3
  Top 0.2: U$3.5 76.87,65.08 v77.03,65.29 77.24,65.2 5_GND.TP | U$3.19 69.87,64.38 69.62,64.63 61.11,64.63 19_GND.TP
  Top 0.254: U$3.24 71.87,57.07 71.78,56.98 71.78,56.92 68.8,53.94 66.34,53.94 66.29,53.89 24_BISENN.TP | U$3.29 74.3,58.12 74.3,55.12 71.19,52.01 29_GND.TP | U$3.33 76.37,53.45 33_AISENN.TP | U$3.38 79.7,57.36 38_GND.TP
  Top 0.406: 24_BISENN.TP 65.62,53.87 64.43,52.68 57.83,52.68 56.91,52.17 56.86,52.15 | U$15.P$1 U$15.P1.1 | v36.51,39 39.21,41.7 v39.21,48.02
  Top 0.5: MSP430_G2553.20 109.64,86 109.78,86.14 109.78,85.58 SV2.1 | MSP430.4 105.13,85.27 105.13,77.93 104.39,77.19 R14.1 100.34,77.19 R13.1 100.39,77.27 100.72,76.94 97.9,76.94 R12.1 95.84,77.18 v95.73,77.07 | GND.4 51.39,82.11 55.77,77.73 57.28,77.73 R4.1 57.64,77.67 R3.1 60.11,77.57 R2.1 R1.1 65.25,77.48 v67.49,77.48 | v68.76,77.4 68.85,77.31 R23.1 71.11,77.38 R7.1 73.59,77.3 R6.1 76.05,77.26 R5.1 78.59,77.17 v80.08,77.17 | v81.76,77.25 81.91,77.4 R8.1 84,77.43 R9.1 86.72,77.4 R10.1 89.54,77.13 92.27,77.13 91.99,77.41 R11.1 91.95,77.25 v93.41,77.25 | U$3.PPAD1 72.91,61.3 | U$3.P$1 77.17,61.3 | 80.2,62.4 80.21,62.98
  Top 0.508: 29_GND.TP 66.78,46.23 66.55,46 | v49,35 50,36 50,43 | C4.1 v76.13,70.83 76.86,71.56 C2.1 | C5.1 81.07,70.25 v81.05,70.75
  Top 0.8: 33_AISENN.TP 77.06,52.74 78.76,51.04 92.36,51.04 v92.53,50.87 | 38_GND.TP 89.85,57.36 89.87,57.34
  Top 0.813: 89.85,57.36 90.36,57.36 v91,58 | 56.91,52.17 55.16,50.43 v55.16,50.34 | v50.49,46.28 50.49,43.49 50,43 | 66.78,46.23 66.41,45.86 v65.36,45.86
  Bottom 0.2: v77.03,65.29 76.99,65.18 77.02,65.15
  Bottom 0.406: 53.04,48.18 39.37,48.18 v39.21,48.02 | v36.51,39 36.29,39 31.81,34.52 30.04,34.52 U$15.P1.1
  Bottom 0.5: v67.49,77.48 67.57,77.4 v68.76,77.4 | v80.08,77.17 80.16,77.25 v81.76,77.25 | v93.41,77.25 93.49,77.17 v95.73,77.07 | 68.51,61.8 68.2,61.6 68.2,63.1
  Bottom 0.508: v49,35 47.42,33.42 44.9,33.42 44.74,33.26 40.35,30.89 32.11,30.89 U$15.P1.1
  Bottom 0.8: v92.53,50.87 103.25,50.87 106.9,47.22 106.9,35.47 109.58,32.79 125.03,32.79 U$14.P1.1
  Bottom 0.813: v55.16,50.34 51.1,46.28 v50.49,46.28
  Bottom 2.54: U$3.PPAD1 73.26,63.26 74,64 75.5,62.51 U$3.PPAD2 77.57,63 78,63 79,62 77,60 71,60 71,62 72,63 70,63 69,62 69,61 70,60 79,60
  pour Bottom (isolate 1): -7.87,97.63 165.72,98.43 165.72,-6.82 -7.87,-7.62
N$2
  Top 0.5: MSP430_G2553.2 112.19,70.5 SV1.9
N$3
  Top 0.5: MSP430_G2553.3 114.72,70.5 SV1.8
N$4
  Top 0.5: MSP430_G2553.4 117.27,70.5 SV1.7
N$5
  Top 0.5: MSP430_G2553.5 119.81,70.5 SV1.6
N$6
  Top 0.5: MSP430_G2553.6 122.34,70.5 SV1.5
N$7
  Top 0.5: MSP430_G2553.7 124.89,70.5 SV1.4
N$8
  Top 0.5: MSP430_G2553.8 127.42,70.5 SV1.3
N$9
  Top 0.5: MSP430_G2553.9 129.97,70.45 130.37,70.05 130.37,70.1 SV1.2
N$10
  Top 0.5: MSP430_G2553.10 132.5,70.5 SV1.1
N$11
  Top 0.5: MSP430_G2553.11 132.5,85.36 SV2.10
N$12
  Top 0.5: MSP430_G2553.12 129.97,85.36 SV2.9
N$13
  Top 0.5: MSP430_G2553.13 127.42,85.36 SV2.8
N$14
  Top 0.5: MSP430_G2553.14 124.89,85.36 SV2.7
N$15
  Top 0.5: MSP430_G2553.15 122.34,85.36 SV2.6
N$16
  Top 0.5: MSP430_G2553.18 114.72,84.59 114.77,84.64 114.77,85.31 SV2.3
N$17
  Top 0.5: MSP430_G2553.19 112.19,85.36 SV2.2
N$18
  Top 0.5: LED1.C 65.11,79.52 R1.2
N$19
  Top 0.5: LED2.C 62.63,79.5 R2.2
N$20
  Top 0.5: LED3.C 60.07,79.63 R3.2
N$21
  Top 0.5: LED4.C R4.2
N$22
  Top 0.5: LED5.C 78.56,79.22 R5.2
N$23
  Top 0.5: LED6.C 75.99,79.22 R6.2
N$24
  Top 0.5: LED7.C 73.49,79.3 R7.2
N$26
  Top 0.5: LED15.C 122.97,65.95 120.5,65.95 120.78,66.23 R15.1
N$27
  Top 0.5: LED17.C 112.12,44.04 R17.1
N$28
  Top 0.5: LED18.C 137.81,46.89 R18.1
N$29
  Top 0.5: LED16.C 140.99,62.94 R16.1
N$30
  Top 0.5: LED19.C 46.38,67.83 R19.2
N$31
  Top 0.152: R20.1 15.8,61.17 LED20.C
  Top 0.406: 15.91,61.04 R20.1
N$32
  Top 0.5: R22.1 15.9,46.95 LED22.C
N$33
  Top 0.406: LED21.C 45.09,48.05 R21.1
N$36
  Top 0.5: LED23.C 71,79.25 R23.2
N$45
  Top 0.5: LED14.C 102.72,79.13 R14.2
N$46
  Top 0.5: LED13.C 100.19,79.24 R13.2
N$47
  Top 0.5: LED12.C 97.63,79.11 R12.2
N$48
  Top 0.5: LED11.C 91.87,79.39 R11.2
N$49
  Top 0.5: LED10.C 89.31,79.34 R10.2
N$50
  Top 0.5: LED9.C 86.77,79.41 R9.2
N$51
  Top 0.5: LED8.C 84.03,79.36 R8.2
RESET  (via drill 0.4)
  Top 0.2: U$3.9 74.87,65.59 72.03,68.43 9_RESET.TP
  Top 0.5: OTHER.2 86.74,82.96 87,82.7 87,82.96 LED9.A | 9_RESET.TP v73.11,72.21 v73.11,72.22
  Bottom 0.5: v73.11,72.22 73.69,72.8 76.2,72.8 76.22,72.78 82.82,72.78 86.74,76.7 OTHER.2
RST  (via drill 0.4)
  Top 0.152: MSP430_G2553.16 119.81,81.42 119.8,81.42
  Top 0.5: MSP430.3 LED14.A | v115.87,77.57 118.77,77.57 119.8,78.6 119.8,81.42 119.76,81.46 | MSP430_G2553.16 119.81,85.36 SV2.5
  Bottom 0.5: MSP430.3 102.62,85.3 102.62,79.33 104.38,77.57 v115.87,77.57
SCLK  (via drill 0.4)
  Top 0.2: U$3.14 72.37,65.12 70.16,67.33 66.22,67.33 65.05,68.5 65.05,70.7 14_SCLK.TP
  Top 0.5: SPI.1 65.16,83.39 LED1.A | 14_SCLK.TP 65.16,70.81 v65.16,71.85
  Bottom 0.5: v65.16,71.85 SPI.1
SCS  (via drill 0.4)
  Top 0.2: U$3.16 71.37,64.78 69.84,66.31 64.09,66.31 63.11,67.29 63.11,68.85 16_SCS.TP
  Top 0.5: SPI.3 LED3.A | 16_SCS.TP 62.18,69.78 v62.14,69.78
  Bottom 0.5: v62.14,69.78 60.08,71.84 SPI.3
SDATAI  (via drill 0.4)
  Top 0.2: U$3.15 71.87,65.01 70.07,66.81 65.07,66.81 63.81,68.07 15_SDATAI.TP
  Top 0.5: SPI.2 LED2.A | 15_SDATAI.TP 63.13,70.76 v62.97,70.76
  Bottom 0.5: v62.97,70.76 62.62,71.11 SPI.2
SDATAO  (via drill 0.4)
  Top 0.2: U$3.17 70.78,63.89 70.78,64.76 69.93,65.61 63.43,65.61 63.43,65.75 62.23,66.95 62.23,67.77 17_SDATAO.TP
  Top 0.5: SPI.4 57.54,83.48 LED4.A | 17_SDATAO.TP 61.42,68.58 v61.17,68.68
  Bottom 0.5: v61.17,68.68 57.54,72.41 SPI.4
SLEEPN  (via drill 0.4)
  Top 0.2: U$3.8 75.37,65.94 73.37,67.94 73.37,71.11 8_SLEEPN.TP
  Top 0.5: OTHER.1 84.2,83.33 LED8.A | 8_SLEEPN.TP 73.69,71.43 73.69,71.61 75.64,73.57 v75.61,73.64
  Bottom 0.5: v75.61,73.64 75.8,73.74 82.46,73.74 84.2,75.48 OTHER.1
TEST
  Top 0.254: 100.38,86.78 arc45 100.19,86.33 MSP430.2
  Top 0.5: MSP430_G2553.17 117.27,85.36 SV2.4 | MSP430.2 LED13.A
  Bottom 0.5: MSP430.2 100.26,85.34 100.26,78.89 102.64,76.51 116.3,76.51 117.27,77.47 MSP430_G2553.17
V_MSP430  (via drill 0.4)
  Top 0.5: SV1.10 109.57,70.58 109.57,71.04 109.64,71.11 MSP430_G2553.1 109.52,74.42 v107.31,74.42 | MSP430.1 97.65,82.99 LED12.A
  Bottom 0.5: v107.31,74.42 107.31,74.59 106.4,75.5 100.2,75.5 97.6,78.1 97.6,85.36 MSP430.1
VCC  (via drill 0.6)
  Top 0.2: U$3.4 77.37,64.68 78.63,65.94 78.66,65.94 78.73,66 79.63,66 80.29,66.66 80.29,67.47 C5.2 80.57,67.51 VCP.1 82.58,71.01 4_VM.TP
  Top 0.5: 18.6,55.1 19.27,54.43 B2HS.2 19.27,54.67 20.2,55.6
  Top 1: v89.35,63.46 89.85,62.96 v90.93,62.96 | v92.19,63.82 92.19,62.41 v91.86,62.08 | v90.38,61.53 90.38,61.74 v89.78,62.34 | v88.34,61 89.33,61 v89.95,60.38 | v84.83,59.75 85.78,60.7 v86.4,60.7
  Top 1.016: VCP.1 83.06,70 85,70
  Top 2: B1HS.2 41.2,58.01 41.2,60.9 40.6,60.3 40.3,60.3 40.4,60.4 42.1,60.4 | v74.1,43 73.7,42.6 72.6,42.6 | v71.8,45.2 71.7,45.3 70.85,45.3 | v76,42.4 75.2,41.6 75.2,41 | v78,41.6 79.7,39.9 | 68.7,44.8 68.7,45.95 69.58,46.82
  Bottom 1: 89.62,64.03 89.62,63.73 v89.35,63.46 | v90.93,62.96 91.79,63.82 v92.19,63.82 | v91.86,62.08 91.31,61.53 v90.38,61.53 | v89.78,62.34 88.44,61 v88.34,61 | v89.95,60.38 85.46,60.38 v84.83,59.75
  Bottom 5: v73.6,47.1 73.6,48.8 74.5,49.7 71.2,49.7 70.6,50.3 70.6,52.2 66.6,56.2 66.6,57.5 65.5,58.6 65.5,59.1 v63.1,61.5
  Bottom 6: 73.6,48.8 75.85,48.8 90.13,63.08 90.25,63.08 90.25,63.4 89.62,64.03
  other vias: 74.1,44.8 79.9,42.7 81.3,43.6 80.4,44.7 61.6,61.8 62.3,60.4 65.8,60.8 64.3,60.5 64.9,62 63.2,62.6 61.7,63.1 66,59.4 87.3,61.9 87.5,63.7 87.89,59.65 88.5,62.4 90.4,64.5 88.6,65
  pour Top (isolate 1, rank 6): -5.4,97.37 163.16,97.97 163.16,-2.97 -5.4,-3.57
VCP
  Top 0.2: U$3.3 77.87,64.65 78.81,65.59 78.85,65.59 78.91,65.65 80.71,65.65 VCP.2 84.01,67.52 3_VCP.TP
VINT
  Top 0.2: U$3.7 75.87,67.26 C4.2 76.01,67.52 74.91,68.62 74.91,70.92 7_VINT.TP

### Text on the board
tNames: GND | VCC | gnd | gnd | gnd | gnd | SDO | SCS | SDI | SCLK | BIN2 | BIN1 | AIN2 | AIN1 | SLEEPN | RESET | 5V | TEST | RESET | GND | FAULTN | v_MSP430 | Dedicated to Damien Ng | Who brought REV back from the dead | REV Motor Control 3.0
bNames: SEM-PURPOSE-BUILT
_tNames: GND | GND | GND | GND | SDO | SCS | SDI | SCLK | BIN2 | BIN1 | AIN2 | AIN1 | SLEEPN | RESET | 5V | TEST | RESET | GND | FAULTN | V+MSP430 | 20 | 19 | 18 | 17 | 16 | 15 | 14 | 13 | 12 | 11 | 5 | 1 | 2 | 3 | 4 | 6 | 7 | 8 | 9 | 10